# Altium schematic sheet Sensors.SchDoc
size A4
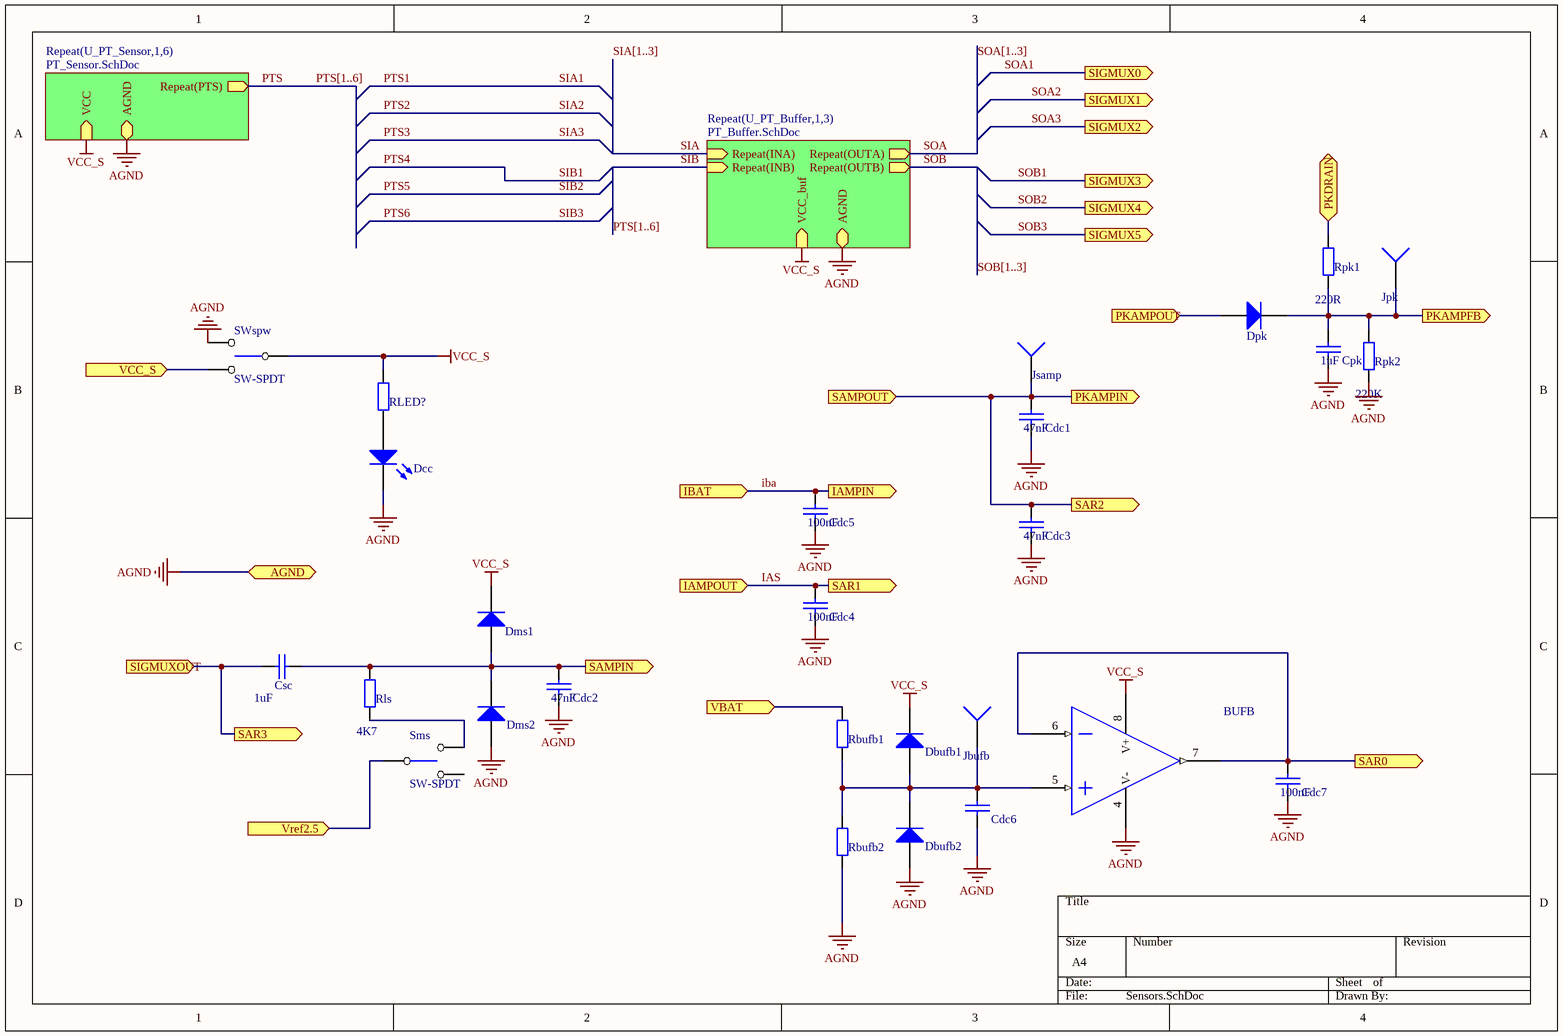
[diagram p0: Sensors.SchDoc]

## Parts
BUF  LT6221  [ECE-SO8]  (value not drawn)  (part B of 2)
Cdc1  47nF  [ECE-CAPC2012-0805SM]
Cdc2  47nF  [ECE-CAPC2012-0805SM]
Cdc3  47nF  [ECE-CAPC1608-0603SM]
Cdc4  100nF  [ECE-CAPC2012-0805SM]
Cdc5  100nF  [ECE-CAPC2012-0805SM]
Cdc6  100nF  [ECE-CAPC1608-0603SM]  (value not drawn)
Cdc7  100nF  [ECE-CAPC2012-0805SM]
Cpk  1uF  [ECE-CAPC1608-0603SM]
Csc  1uF  [ECE-CAPC2012-0805SM]
Dbufb1  1N4148  [ECE-DIO10.46-5.3x2.8TH]  (value not drawn)
Dbufb2  1N4148  [ECE-DIO10.46-5.3x2.8TH]  (value not drawn)
Dcc  LTST-C170KAKT  [ECE-LED2012-0805SM]  (value not drawn)
Dms1  1N4148  [ECE-DIO10.46-5.3x2.8TH]  (value not drawn)
Dms2  1N4148  [ECE-DIO10.46-5.3x2.8TH]  (value not drawn)
Dpk  1N4148  [ECE-DIO10.46-5.3x2.8TH]  (value not drawn)
Jbufb  TEST PIN  [ECE-HDR1TH]  (value not drawn)
Jpk  TEST PIN  [ECE-HDR1TH]  (value not drawn)
Jsamp  TEST PIN  [ECE-HDR1TH]  (value not drawn)
Rbufb1  47K  [ECE-RESC1608-0603SM]  (value not drawn)
Rbufb2  56K  [ECE-RESC2012-0805SM]  (value not drawn)
RLED?  270R  [ECE-RESC1608-0603SM]  (value not drawn)
Rls  4K7  [ECE-RESC2012-0805SM]
Rpk1  220R  [ECE-RESC1608-0603SM]
Rpk2  220K  [ECE-RESC1608-0603SM]
Sms  SW-SPDT  [SW-SPDT]
SWspw  SW-SPDT  [SW-SPDT]

## Sub-sheets
Repeat(U_PT_Buffer,1,3) = PT_Buffer.SchDoc: Repeat(INA) (in), Repeat(INB) (in), Repeat(OUTA) (out), Repeat(OUTB) (out), VCC_buf (in), AGND
Repeat(U_PT_Sensor,1,6) = PT_Sensor.SchDoc: Repeat(PTS) (out), VCC (in), AGND (bidir)

## Ports
AGND (bidir), IAMPIN (out), IAMPOUT (in), IBAT (in), PKAMPFB (out), PKAMPIN (out), PKAMPOUT (in), PKDRAIN (bidir), SAMPIN (out), SAMPOUT (in), SAR0 (out), SAR1 (out), SAR2 (out), SAR3 (out), SIGMUX0 (out), SIGMUX1 (out), SIGMUX2 (out), SIGMUX3 (out), SIGMUX4 (out), SIGMUX5 (out), SIGMUXOUT (in), VBAT (in), VCC_S (in), Vref2.5 (in)

## Nets
AGND: BUF.4(V-) Cdc1.2 Cdc2.2 Cdc3.2 Cdc4.2 Cdc5.2 Cdc6.2 Cdc7.2 Cpk.2 Dbufb2.1(A) Dcc.2(K) Dms2.1(A) Rbufb2.1 Rpk2.1 SWspw.3 ; port AGND, sheet Repeat(U_PT_Sensor,1,6)/AGND, sheet Repeat(U_PT_Buffer,1,3)/AGND
VCC_S: BUF.8(V+) Dbufb1.2(K) Dms1.2(K) RLED?.2 SWspw.2 ; sheet Repeat(U_PT_Sensor,1,6)/VCC, sheet Repeat(U_PT_Buffer,1,3)/VCC_buf
IAS: Cdc4.1 ; port IAMPOUT, port SAR1
iba: Cdc5.1 ; port IBAT, port IAMPIN
PKAMPFB: Cpk.1 Dpk.2(K) Jpk.1 Rpk1.1 Rpk2.2 ; port PKAMPFB
PKAMPIN: Cdc1.1 Cdc3.1 Jsamp.1 ; port SAMPOUT, port SAR2, port PKAMPIN
PKAMPOUT: Dpk.1(A) ; port PKAMPOUT
PKDRAIN: Rpk1.2 ; port PKDRAIN
PTS: sheet Repeat(U_PT_Sensor,1,6)/Repeat(PTS)
SAMPIN: Cdc2.1 Csc.2 Dms1.1(A) Dms2.2(K) Rls.2 ; port SAMPIN
SAR0: BUF.6(IN2(-)) BUF.7(OUT2) Cdc7.1 ; port SAR0
SAR3: Csc.1 ; port SIGMUXOUT, port SAR3
SIA: sheet Repeat(U_PT_Buffer,1,3)/Repeat(INA)
SIB: sheet Repeat(U_PT_Buffer,1,3)/Repeat(INB)
SOA: sheet Repeat(U_PT_Buffer,1,3)/Repeat(OUTA)
SOA1: port SIGMUX0
SOA2: port SIGMUX1
SOA3: port SIGMUX2
SOB: sheet Repeat(U_PT_Buffer,1,3)/Repeat(OUTB)
SOB1: port SIGMUX3
SOB2: port SIGMUX4
SOB3: port SIGMUX5
VBAT: Rbufb1.2 ; port VBAT
VCC_S: SWspw.1 ; port VCC_S  [a separate net that carries the same name]
Vref2.5: Sms.2 ; port Vref2.5
NetBUF_5: BUF.5(IN2(+)) Cdc6.1 Dbufb1.1(A) Dbufb2.2(K) Jbufb.1 Rbufb1.1 Rbufb2.2
NetDcc_1: Dcc.1(A) RLED?.1
NetRls_1: Rls.1 Sms.1

Not connected (* = marked no-connect by the designer): Sms 3

## Buses and harness runs
bus PTS[1..6]
bus SIA[1..3]
bus SOA[1..3]
bus SOB[1..3]

## Library data of the parts
BUF = OPA000102: IC OPAMP LT6221 DUAL SM; Manufactuer: Linear Technology; Manufacturer-PN: LT6221CS8#TRPBF; Assembly Method: Surface Mount; Item Type: Item; Path: ece/ts/Lists/Stock Inventory; UoA Stock#: OPA000102; Value: LT6221; Size/Package: S8; Datasheet Link: http://share.engineering.auckland.ac.nz/ece/ts/Student%20Documents/LT6221.pdf; Supplier1: Arrow; Supplier1-PN: LT6221CS8#TRPBF; Supplier2: Digikey; Supplier2-PN: LT6221CS8#PBF-ND; Component Type: S8-LT6221; Category: OpAmp; Status: Active
Cdc1 Cdc2 = CAP000522: CAP CER 47nF 50V X7R SM0805; Manufactuer: Samsung; Manufacturer-PN: CL21B473KBCNNNC; Assembly Method: Surface Mount; Item Type: Item; Path: ece/ts/Lists/Stock Inventory; Value: 47nF; UoA Stock#: CAP000522; Size/Package: 0805 (2012 Metric); Voltage/Current: 50V; Supplier1: Digikey; Supplier1-PN: 1276-1250-2-ND; Component Type: CAP-0805-47nF; Category: Capacitor; Status: Active
Cdc3 = CAP000622: CAP CER 47nF 50V X7R SM0603; Manufactuer: Samsung; Manufacturer-PN: CL10B473KB8NNNC; Assembly Method: Surface Mount; Item Type: Item; Path: ece/ts/Lists/Stock Inventory; Value: 47nF; UoA Stock#: CAP000622; Size/Package: 0603 (1608 Metric); Voltage/Current: 50V; Supplier1: Digikey; Supplier1-PN: 1276-1063-2-ND; Component Type: CAP-0603-47nF; Category: Capacitor; Status: Active
Cdc4 Cdc5 Cdc7 = CAP000524: CAP CER 100nF 50V X7R SM0805; Manufactuer: Samsung; Manufacturer-PN: CL21B104KBCNNNC; Assembly Method: Surface Mount; Item Type: Item; Path: ece/ts/Lists/Stock Inventory; Value: 100nF; UoA Stock#: CAP000524; Size/Package: 0805 (2012 Metric); Voltage/Current: 50V; Supplier1: Digikey; Supplier1-PN: 276-1003-2-ND; Component Type: CAP-0805-100nF; Category: Capacitor; Status: Active
Cdc6 = CAP000624: CAP CER 100nF 25V X7R SM0603; Manufactuer: Kemet; Manufacturer-PN: C0603C104K3RACTU; Assembly Method: Surface Mount; Item Type: Item; Path: ece/ts/Lists/Stock Inventory; Value: 100nF; UoA Stock#: CAP000624; Size/Package: 0603 (1608 Metric); Voltage/Current: 25V; Supplier1: Digikey; Supplier1-PN: 399-1281-2-ND; Component Type: CAP-0603-100nF; Category: Capacitor; Status: Active
Cpk = CAP000630: CAP CER 1uF 50V X7R SM0603; Manufactuer: Samsung; Manufacturer-PN: CL10B105KA8NNNC; Assembly Method: Surface Mount; Voltage/Current: 25V; Item Type: Item; Path: ece/ts/Lists/Stock Inventory; Value: 1uF; UoA Stock#: CAP000630; Size/Package: 0603 (1608 Metric); Supplier1: Digikey; Supplier1-PN: 1276-1184-2-ND; Component Type: CAP-0603-1uF; Category: Capacitor; Status: Active
Csc = CAP000530: CAP CER 1uF 50V X7R SM0805; Manufactuer: Samsung; Manufacturer-PN: CL21B105KBFNNNE; Assembly Method: Surface Mount; Item Type: Item; Path: ece/ts/Lists/Stock Inventory; Value: 1uF; UoA Stock#: CAP000530; Size/Package: 0805 (2012 Metric); Voltage/Current: 50V; Supplier1: Digikey; Supplier1-PN: 1276-1029-2-ND; Component Type: CAP-0805-1uF; Category: Capacitor; Status: Active
Dbufb1 Dbufb2 Dms1 Dms2 Dpk = DIO000005: Small Signal Diode 2A 100V TH; Manufactuer: VISHAY SEMICONDUCTOR; Assembly Method: Through hole; Voltage/Current: 2A-100V; Item Type: Item; Path: ece/ts/Lists/Stock Inventory; Value: 1N4148; UoA Stock#: DIO000005; Size/Package: Axial; Manufacturer-PN: 1N4148; Datasheet Link: http://share.engineering.auckland.ac.nz/ece/ts/Student%20Documents/1N4148_diode.pdf; Supplier1: Element14; Supplier1-PN: 1612346; Category: Diode; Status: Active
Dcc = DIO000105: LED RED ORANGE CLEAR 0805 SMD; Manufactuer: Lite-On Inc; Assembly Method: Surface Mount; Voltage/Current: 20mA; Item Type: Item; Path: ece/ts/Lists/Stock Inventory; UoA Stock#: DIO000105; Value: LTST-C170KAKT; Size/Package: 0805 (2012 Metric); Manufacturer-PN: LTST-C170KAKT; Datasheet Link: http://share.engineering.auckland.ac.nz/ece/ts/Student%20Documents/LED-S_110_LTST-C170KAKT.pdf; Supplier1: Digikey; Supplier1-PN: 160-1412-6-ND; Component Type: LED-0805-RED; Category: Diode; Status: Active
Jbufb Jpk Jsamp = CON000017: Value: 1 way; Assembly Method: Through hole; Item Type: Item; Path: ece/ts/Lists/Stock Inventory; UoA Stock#: CON000017; Component Type: NA; Category: Connector; Status: Active
Rbufb1 = RES000158: RES CER 47K 1608 SM; Manufactuer: Yageo; Manufacturer-PN: RC0603FR-0747KL; Assembly Method: Surface Mount; Voltage/Current: 1/10W; Item Type: Item; Path: ece/ts/Lists/Stock Inventory; Value: 47K; UoA Stock#: RES000158; Size/Package: 1608 (0603); Supplier1: Digikey; Supplier1-PN: 311-47.0KHRTR-ND; Component Type: RES-1608-47K; Category: Resistor; Status: Active; Datasheet Link: http://share.engineering.auckland.ac.nz/ece/ts/Student%20Documents/Yageo-Resistors.pdf
Rbufb2 = RES000559: RES CER 56K 2012 SM; Assembly Method: Surface Mount; Voltage/Current: 1/8W; Item Type: Item; Path: ece/ts/Lists/Stock Inventory; Value: 56K; UoA Stock#: RES000559; Size/Package: 2012 (0805); Component Type: RES-2012-56K; Category: Resistor; Status: Active
RLED? = RES000131: RES CER 270R 1608 SM; Assembly Method: Surface Mount; Voltage/Current: 1/10W; Item Type: Item; Path: ece/ts/Lists/Stock Inventory; Value: 270R; UoA Stock#: RES000131; Size/Package: 1608 (0603); Component Type: RES-1608-270R; Category: Resistor; Status: Active
Rls = RES000546: RES CER 4K7 2012 SM; Assembly Method: Surface Mount; Voltage/Current: 1/8W; Item Type: Item; Path: ece/ts/Lists/Stock Inventory; Value: 4K7; UoA Stock#: RES000546; Size/Package: 2012 (0805); Component Type: RES-2012-4K7; Category: Resistor; Status: Active
Rpk1 = RES000130: RES CER 220R 1608 SM; Manufactuer: Samsung; Manufacturer-PN: RC1608F221CS; Assembly Method: Surface Mount; Voltage/Current: 1/10W; Item Type: Item; Path: ece/ts/Lists/Stock Inventory; Value: 220R; UoA Stock#: RES000130; Size/Package: 1608 (0603); Supplier1: Digikey; Supplier1-PN: 1276-3496-2-ND; Component Type: RES-1608-220R; Category: Resistor; Status: Active; Datasheet Link: http://share.engineering.auckland.ac.nz/ece/ts/Student%20Documents/Samsung-CHIP_RESISTOR_150112_1.pdf
Rpk2 = RES000166: RES CER 220K 1608 SM; Manufactuer: Yageo; Manufacturer-PN: RC0603FR-07220KL; Assembly Method: Surface Mount; Voltage/Current: 1/10W; Item Type: Item; Path: ece/ts/Lists/Stock Inventory; Value: 220K; UoA Stock#: RES000166; Size/Package: 1608 (0603); Supplier1: Digikey; Supplier1-PN: 311-220KHRTR-ND; Component Type: RES-1608-220K; Category: Resistor; Status: Active; Datasheet Link: http://share.engineering.auckland.ac.nz/ece/ts/Student%20Documents/Yageo-Resistors.pdf
Sms SWspw = SW-SPDT: Toggle Switch